# EAGLE design IOIOShield (EAGLE 6.6.0)
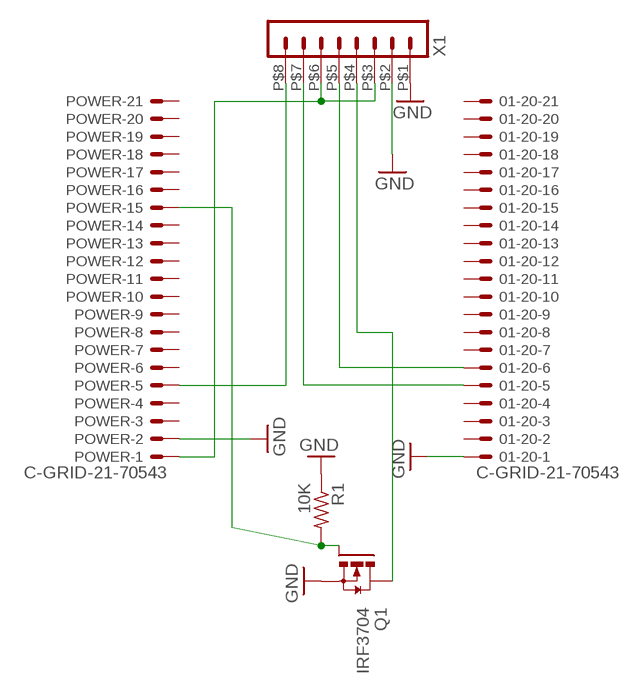
[diagram p0: schematic, sheet 1]

## Parts
01-20  C-GRID-21-70543  [70543-21]
POWER  C-GRID-21-70543  [70543-21]
Q1  IRF3704  [TO220AH]
R1  10K  R-US_0204/7  [0204/7]
X1  HEADER_POS8_43045-0800  [43045-0800]

## Nets
GND: 01-20.1 POWER.2 Q1.E(S) R1.1 X1.P$1 X1.P$2
N$1: POWER.15 Q1.B(G) R1.2
N$2: Q1.C(D) X1.P$4
N$3: POWER.1 X1.P$3 X1.P$6
N$5: POWER.5 X1.P$8
N$6: 01-20.6 X1.P$5
N$8: 01-20.5 X1.P$7
Unconnected: 01-20.2 01-20.3 01-20.4 01-20.7 01-20.8 01-20.9 01-20.10 01-20.11 01-20.12 01-20.13 01-20.14 01-20.15 01-20.16 01-20.17 01-20.18 01-20.19 01-20.20 01-20.21 POWER.3 POWER.4 POWER.6 POWER.7 POWER.8 POWER.9 POWER.10 POWER.11 POWER.12 POWER.13 POWER.14 POWER.16 POWER.17 POWER.18 POWER.19 POWER.20 POWER.21

## Library data of the parts
01-20 POWER = con-molex:C-GRID-21: CONNECTOR wire to board 2.54 mm (0.100") pitch header; OC_FARNELL: unknown; OC_NEWARK: unknown
Q1 = transistor-power:IRF3704: SMPS MOSFET HEXFET® Power MOSFET Source: http://www.irf.com/product-info/datasheets/data/irf3704.pdf
R1 = rcl:R-US_: RESISTOR, American symbol
X1 = con-molex-micro-fit-3_0:HEADER_POS8_?: Molex - Micro-Fit 3.0 Series connector, 3.00mm (0.118") pitch header, 8 positions.

## Board
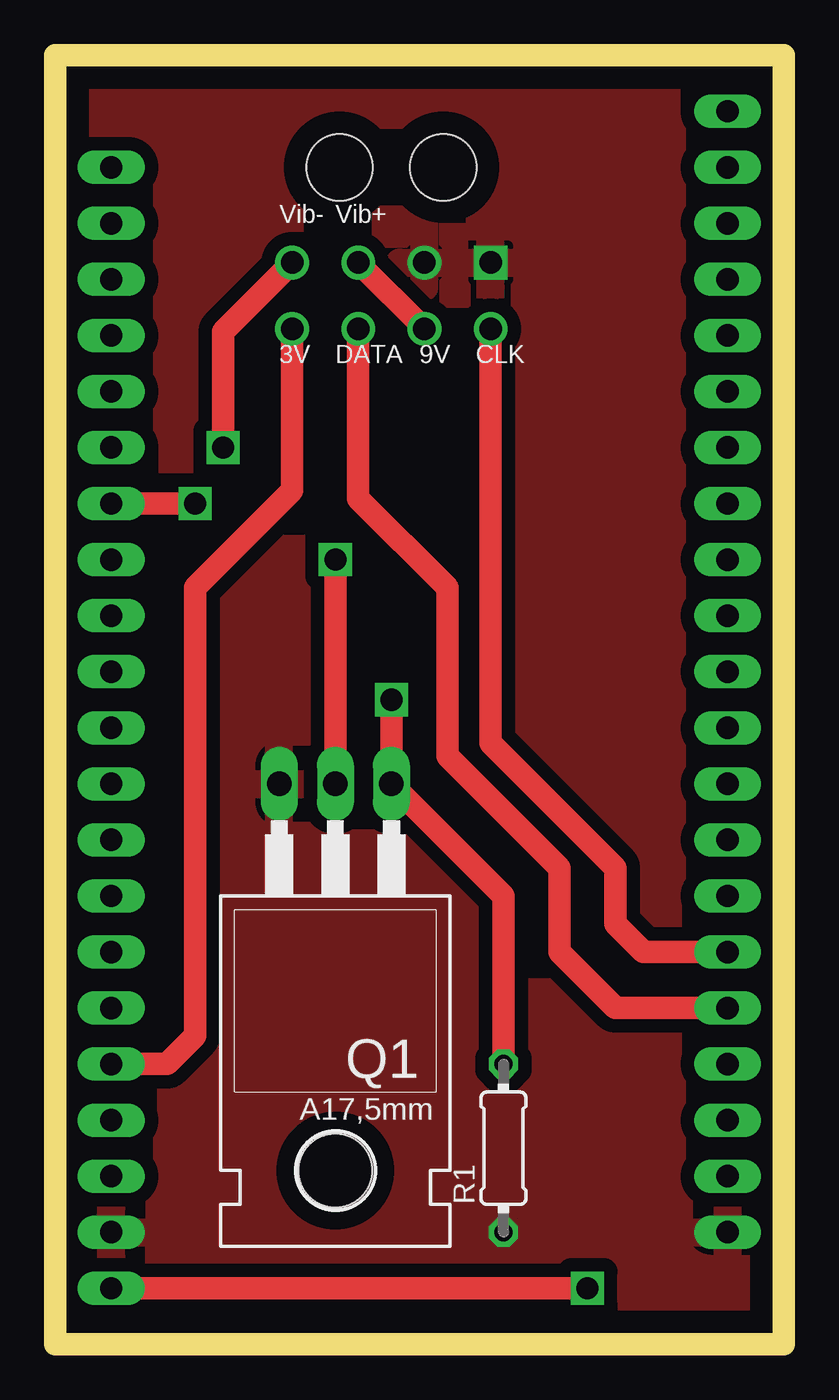
[diagram p1: board, top side]
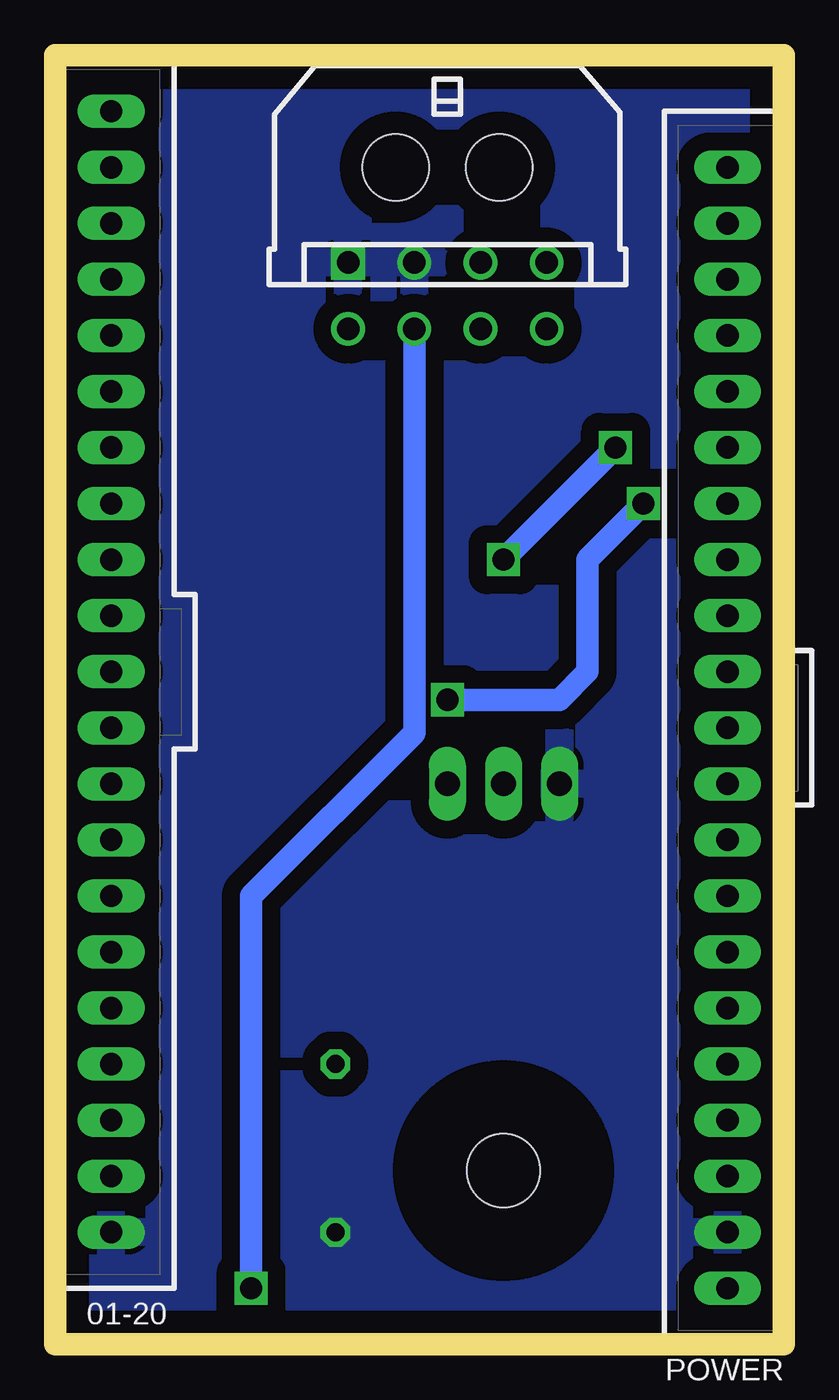
[diagram p2: board, bottom side, seen from below]

Size 33.02 x 58.42 mm. Coordinates in mm from the lower left corner, seen from the top.
Outline: 0,0 33.02,0 33.02,58.42 0,58.42 0,0
Copper layers (1*16): Top 0.035mm / dielectric 1.5mm / Bottom 0.035mm
Design rules "default": minimum track width 10mil, minimum drill 24mil, track to track 8mil, track to pad 8mil, pad to pad 8mil, via to via 8mil, smd to smd 8mil, copper to edge 40mil, drill to drill 8mil, minimum pad ring 10mil, minimum via ring 8mil, stop-mask expansion 4mil, vias tented up to drill 0mil, thermal gap 10mil

### Footprints (pad centres in the part's own frame; a part is rotated, then mirrored left to right if it is on the bottom)
70543-21 = drill 1.016 long: 1 -25.4,0; 2 -22.86,0; 3 -20.32,0; 4 -17.78,0; 5 -15.24,0; 6 -12.7,0; 7 -10.16,0; 8 -7.62,0; 9 -5.08,0; 10 -2.54,0; 11 0,0; 12 2.54,0; 13 5.08,0; 14 7.62,0; 15 10.16,0; 16 12.7,0; 17 15.24,0; 18 17.78,0; 19 20.32,0; 20 22.86,0; 21 25.4,0
TO220AH = drill 1.118 long: B -2.54,-6.35; C 0,-6.35; E 2.54,-6.35 | hole 3.302: 0,11.176
0204/7 = drill 0.813 octagon: 1 -3.81,0; 2 3.81,0
43045-0800 = drill 1.02 square: P$1 4.5,4.32 | drill 1.02: P$2 1.5,4.32; P$3 -1.5,4.32; P$4 -4.5,4.32; P$5 4.5,7.32; P$6 1.5,7.32; P$7 -1.5,7.32; P$8 -4.5,7.32 | hole 3: 2.35,0; -2.35,0

### Placement (x,y rotation side)
01-20  30.48,30.48 90 bottom
POWER  2.54,27.94 90 bottom
Q1  12.7,19.05 180 top
R1  20.32,8.89 90 top
X1  15.24,53.34 180 bottom

### Tracks (layer width: path | path; a pad name or v marks a point on that pad's centre or on a via)
GND
  pour Top (isolate 0.61): -2.54,60.96 35.56,60.96 35.56,-2.54 -2.54,-2.54
  pour Bottom (isolate 0.813): 0,58.42 33.02,58.42 33.02,0 0,0
N$1  (via drill 1)
  Top 1.016: R1.2 20.32,20.32 Q1.B v15.24,29.21 | v6.35,38.1 POWER.15
  Bottom 1.016: v15.24,29.21 10.16,29.21 8.89,30.48 8.89,35.56 v6.35,38.1
N$2  (via drill 1)
  Top 1.016: Q1.C v12.7,35.56 | v7.62,40.64 7.62,45.9 X1.P$4
  Bottom 1.016: v12.7,35.56 v7.62,40.64
N$3  (via drill 1)
  Top 1.016: POWER.1 v24.13,2.54 | X1.P$6 X1.P$3
  Bottom 1.016: v24.13,2.54 24.13,20.32 16.74,27.71 X1.P$6
N$5
  Top 1.016: POWER.5 5.08,12.7 6.35,13.97 6.35,34.29 10.74,38.68 X1.P$8
N$6
  Top 1.016: 01-20.6 26.67,17.78 25.4,19.05 25.4,21.59 19.74,27.25 X1.P$5
N$8
  Top 1.016: 01-20.5 25.4,15.24 22.86,17.78 22.86,21.59 17.78,26.67 17.78,34.29 13.74,38.33 X1.P$7

### Text on the board
tNames: Vib- | Vib+ | 3V | DATA | 9V | CLK